# EAGLE design Qwiic_Power_Meter-ACS37800 (EAGLE 9.6.2)
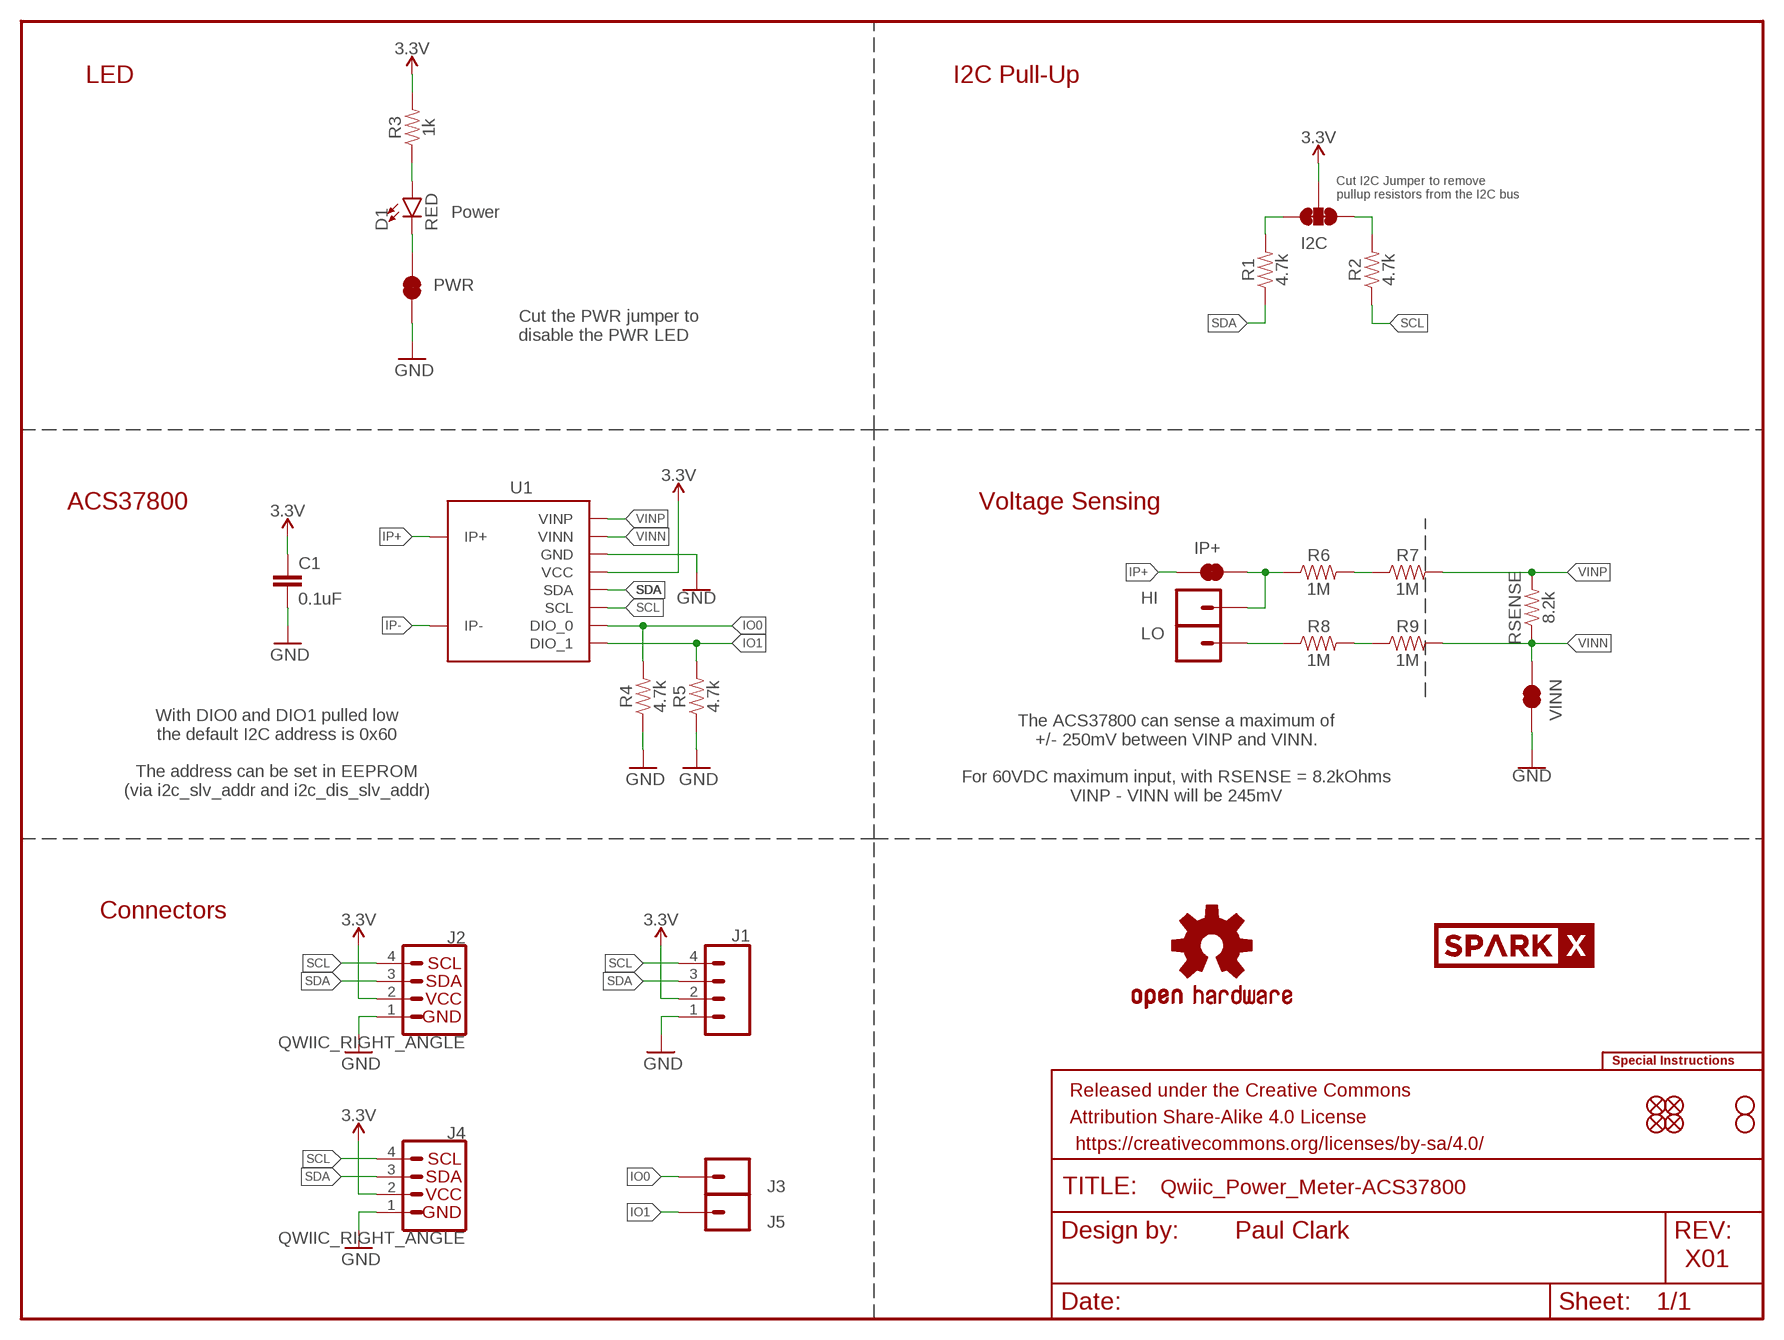
[diagram p0: schematic, sheet 1]

## Parts
C1  0.1uF  0.1UF-0603-25V-(+80/-20%)  [0603]
D1  RED  LED-RED0603  [LED-0603]
FRAME1  FRAME-LETTER  [CREATIVE_COMMONS]
HI  CONN_01PTH_NO_SILK_YES_STOP  [1X01_NO_SILK]
I2C  JUMPER-SMT_3_2-NC_TRACE_SILK  [SMT-JUMPER_3_2-NC_TRACE_SILK]
IP+  JUMPER-SMT_2_NC_TRACE_SILK  [SMT-JUMPER_2_NC_TRACE_SILK]
J1  CONN_041X04_NO_SILK  [1X04_NO_SILK]
J2  QWIIC_RIGHT_ANGLE  QWIIC_CONNECTORJS-1MM  [JST04_1MM_RA]
J3  CONN_01PTH_NO_SILK_YES_STOP  [1X01_NO_SILK]
J4  QWIIC_RIGHT_ANGLE  QWIIC_CONNECTORJS-1MM  [JST04_1MM_RA]
J5  CONN_01PTH_NO_SILK_YES_STOP  [1X01_NO_SILK]
JP1  FIDUCIALUFIDUCIAL  [MICRO-FIDUCIAL]
JP2  FIDUCIALUFIDUCIAL  [MICRO-FIDUCIAL]
JP3  STAND-OFF  [STAND-OFF]
JP4  STAND-OFF  [STAND-OFF]
JP5  FIDUCIALUFIDUCIAL  [MICRO-FIDUCIAL]
JP6  FIDUCIALUFIDUCIAL  [MICRO-FIDUCIAL]
LO  CONN_01PTH_NO_SILK_YES_STOP  [1X01_NO_SILK]
LOGO1  SPECIAL_INSTRUCTIONS-ORDERING  [ORDERING_INSTRUCTIONS]
LOGO5  OSHW-LOGOS  [OSHW-LOGO-S]
PWR  JUMPER-SMT_2_NC_TRACE_SILK  [SMT-JUMPER_2_NC_TRACE_SILK]
R1  4.7k  4.7KOHM-0603-1/10W-1%  [0603]
R2  4.7k  4.7KOHM-0603-1/10W-1%  [0603]
R3  1k  1KOHM-0603-1/10W-1%  [0603]
R4  4.7k  4.7KOHM-0603-1/10W-1%  [0603]
R5  4.7k  4.7KOHM-0603-1/10W-1%  [0603]
R6  1M  1MOHM-0603-1/4W-5%  [0603]
R7  1M  1MOHM-0603-1/4W-5%  [0603]
R8  1M  1MOHM-0603-1/4W-5%  [0603]
R9  1M  1MOHM-0603-1/4W-5%  [0603]
RSENSE  8.2k  8.2KOHM-0603-1/10W-5%  [0603]
U1  ACS37800  [ACS37800_THROUGH_HOLE]
U$18  SPARKX-LOGO3  [SPARKX-SMALL]
VINN  JUMPER-SMT_2_NC_TRACE_SILK  [SMT-JUMPER_2_NC_TRACE_SILK]

## Nets
3.3V: C1.1 I2C.2 J1.2 J2.2 J4.2 R3.2 U1.13(VCC)
GND: C1.2 J1.1 J2.1 J4.1 PWR.1 R4.1 R5.1 U1.14(GND) VINN.2
HI: HI.1 IP+.2 R6.1
IO0: J3.1 R4.2 U1.10(DIO_0)
IO1: J5.1 R5.2 U1.9(DIO_1)
IP+: IP+.1 U1.1(IP+) U1.2(IP+) U1.3(IP+) U1.4(IP+) U1.C_IN(IP+) U1.C_IN_BREAKOUT(IP+) U1.CIN1(IP+) U1.CIN2(IP+) U1.CIN3(IP+) U1.CIN4(IP+) U1.CIN5(IP+) U1.CIN6(IP+) U1.CIN7(IP+) U1.CIN8(IP+) U1.CIN9(IP+) U1.CIN10(IP+) U1.CIN11(IP+) U1.CIN12(IP+) U1.CIN13(IP+) U1.CIN14(IP+) U1.CIN15(IP+) U1.CIN16(IP+) U1.CIN17(IP+) U1.CIN18(IP+) U1.CIN19(IP+) U1.CIN20(IP+) U1.CIN21(IP+) U1.CIN22(IP+) U1.CIN23(IP+) U1.CIN24(IP+) U1.CIN25(IP+) U1.CIN26(IP+) U1.CIN27(IP+) U1.CIN28(IP+) U1.CIN29(IP+) U1.CIN30(IP+) U1.CIN31(IP+) U1.CIN32(IP+) U1.CIN33(IP+) U1.CIN34(IP+) U1.CIN35(IP+) U1.CIN36(IP+)
IP-: U1.5(IP-) U1.6(IP-) U1.7(IP-) U1.8(IP-) U1.C_OUT(IP-) U1.C_OUT_BREAKOUT(IP-) U1.COUT1(IP-) U1.COUT2(IP-) U1.COUT3(IP-) U1.COUT4(IP-) U1.COUT5(IP-) U1.COUT6(IP-) U1.COUT7(IP-) U1.COUT8(IP-) U1.COUT9(IP-) U1.COUT10(IP-) U1.COUT11(IP-) U1.COUT12(IP-) U1.COUT13(IP-) U1.COUT14(IP-) U1.COUT15(IP-) U1.COUT16(IP-) U1.COUT17(IP-) U1.COUT18(IP-) U1.COUT19(IP-) U1.COUT20(IP-) U1.COUT21(IP-) U1.COUT22(IP-) U1.COUT23(IP-) U1.COUT24(IP-) U1.COUT25(IP-) U1.COUT26(IP-) U1.COUT27(IP-) U1.COUT28(IP-) U1.COUT29(IP-) U1.COUT30(IP-) U1.COUT31(IP-) U1.COUT32(IP-) U1.COUT33(IP-) U1.COUT34(IP-) U1.COUT35(IP-) U1.COUT36(IP-)
N$1: D1.C PWR.2
N$2: I2C.3 R1.2
N$3: D1.A R3.1
N$4: I2C.1 R2.2
N$5: R6.2 R7.1
N$6: R8.2 R9.1
N$8: LO.1 R8.1
SCL: J1.4 J2.4 J4.4 R2.1 U1.11(SCL)
SDA: J1.3 J2.3 J4.3 R1.1 U1.12(SDA)
VINN: R9.2 RSENSE.1 U1.15(VINN) VINN.1
VINP: R7.2 RSENSE.2 U1.16(VINP)

## Notes on the sheet
- LED | I2C Pull-Up
- Cut I2C Jumper to remove 
  pullup resistors from the I2C bus
- Power
- Cut the PWR jumper to
  disable the PWR LED
- ACS37800 | Voltage Sensing
- With DIO0 and DIO1 pulled low
  the default I2C address is 0x60
  
  The address can be set in EEPROM
  (via i2c_slv_addr and i2c_dis_slv_addr)
- The ACS37800 can sense a maximum of
  +/- 250mV between VINP and VINN.
  
  For 60VDC maximum input, with RSENSE = 8.2kOhms
  VINP - VINN will be 245mV
- Connectors
- Paul Clark
- X01

## Library data of the parts
C1 = SparkFun-Capacitors:0.1UF: 0.1µF ceramic capacitors A capacitor is a passive two-terminal electrical component used to store electrical energy temporarily in an electric field.; PROD_ID: CAP-00810
D1 = SparkFun-LED:LED-RED: Red SMD LED Used in manufacturing of most products at SparkFun Packages: 0603 - SMD 0603 package [Product Link] <http://docs.avagotech.com/docs/AV02-0551EN> 0603 SMART - SMD 0603 SMART package ( more efficient and expensive)[Product Link] <http://www.osram-os.com/Graphics/XPic2/00077099_0.pdf> 1206 - SMD1206 package [Product Link] <https://www.sparkfun.com/datasheets/DevTools/LilyPad/Q150OVS4.pdff> SparkFun Products: Pro Mini 328 -5V <https://www.sparkfun.com/products/821> RedBoard <https://www.sparkfun.com/products/12757> IOIO-OTG <https://www.sparkfun.com/products/13613>; PROD_ID: DIO-00819
FRAME1 = SparkFun-Aesthetics:FRAME-LETTER: Schematic Frame - Letter Standard 8.5x11 US Letter frame
HI J3 J5 LO = SparkFun-Connectors:CONN_01: Single connection point. Often used as Generic Header-pin footprint for 0.1 inch spaced/style header connections On any of the 0.1 inch spaced packages, you can populate with these: Break Away Headers - Straight <https://www.sparkfun.com/products/116> (PRT-00116) Break Away Male Headers - Right Angle <https://www.sparkfun.com/products/553> (PRT-00553) Female Headers <https://www.sparkfun.com/products/115> (PRT-00115) Break Away Headers - Machine Pin <https://www.sparkfun.com/products/117> (PRT-00117) Break Away Female Headers - Swiss Machine Pin <https://www.sparkfun.com/products/743> (PRT-00743) This device is also useful as a general connection point to wire up your design to another part of your project. Our various solder wires solder well into these plated through hole pads. Hook-Up Wire - Assortment (Stranded, 22 AWG) <https://www.sparkfun.com/products/11375> (PRT-11375) Hook-Up Wire - Assortment (Solid Core, 22 AWG) <https://www.sparkfun.com/products/11367> (PRT-11367) View the entire wire category on our website here <https://www.sparkfun.com/categories/141> Special notes: SMTSO-256-ET is a "flush mount" nut for a 4-40 screw. We mostly use this on specialty testbeds; it is a nice way to connect hardware to your PCB at an adjustable hieght. Also note, the SNAP packages are for using a snappable style connector. We sell a baggie of snaps and they are also used on two LilyPad designs: Snap Assortment - 30 pack (male and female) <https://www.sparkfun.com/products/11347> (DEV-11347) LilyPad Arduino SimpleSnap <https://www.sparkfun.com/products/10941> (DEV-10941) LilyPad SimpleSnap Protoboard <https://www.sparkfun.com/products/10940> (DEV-10940)
I2C = SparkFun-Jumpers:JUMPER-SMT_3_2-NC_TRACE: Normally closed trace jumper (2 of 2 connections) This jumper has a trace between all three pads so they are normally closed (NC). Use a razor knife to open the connection(s). For best results follow the IPC guidelines for cutting traces: Cutout at least 0.063 mm (0.005 in). Remove all loose material to clean up the cut area. Seal the cut with an approved epoxy. Reapply solder to reclose the connection(s).
IP+ PWR VINN = SparkFun-Jumpers:JUMPER-SMT_2_NC_TRACE: Normally closed trace jumper This jumper has a trace between two pads so it's normally closed (NC). Use a razor knife to open the connection. For best results follow the IPC guidelines for cutting traces: Cutout at least 0.063 mm (0.005 in). Remove all loose material to clean up the cut area. Seal the cut with an approved epoxy. Reapply solder to reclose the connection.
J1 = SparkFun-Connectors:CONN_04: Multi connection point. Often used as Generic Header-pin footprint for 0.1 inch spaced/style header connections On any of the 0.1 inch spaced packages, you can populate with these: Break Away Headers - Straight <https://www.sparkfun.com/products/116> (PRT-00116) Break Away Male Headers - Right Angle <https://www.sparkfun.com/products/553> (PRT-00553) Female Headers <https://www.sparkfun.com/products/115> (PRT-00115) Break Away Headers - Machine Pin <https://www.sparkfun.com/products/117> (PRT-00117) Break Away Female Headers - Swiss Machine Pin <https://www.sparkfun.com/products/743> (PRT-00743) For SCREWTERMINALS and SPRING TERMINALS visit here: Screw Terimnals on SparkFun.com <https://www.sparkfun.com/search/results?term=Screw+Terminals> (5mm/3.5mm/2.54mm spacing) This device is also useful as a general connection point to wire up your design to another part of your project. Our various solder wires solder well into these plated through hole pads. Hook-Up Wire - Assortment (Stranded, 22 AWG) <https://www.sparkfun.com/products/11375> (PRT-11375) Hook-Up Wire - Assortment (Solid Core, 22 AWG) <https://www.sparkfun.com/products/11367> (PRT-11367) View the entire wire category on our website here <https://www.sparkfun.com/categories/141> Special notes: Molex polarized connector foot print use with SKU : PRT-08231 with associated crimp pins and housings. 1MM SMD Version SKU: PRT-10208; PROD_ID: CONN-09696
J2 J4 = SparkFun-Connectors:QWIIC_CONNECTOR: SparkFun I2C Standard Qwiic Connector An SMD 1mm pitch JST connector makes it easy and quick (get it? Qwiic?) to connect I2C devices to each other. The Qwiic system <http://www.sparkfun.com/qwiic> enables fast and solderless connection between popular platforms and various sensors and actuators. We carry 200mm <https://www.sparkfun.com/products/14204>, 100mm <https://www.sparkfun.com/products/14205>, 50mm <https://www.sparkfun.com/products/14206>, and breadboard friendly <https://www.sparkfun.com/products/14207> Qwiic cables. We also offer 10 pcs strips <https://www.sparkfun.com/products/14323> the SMD connectors.; PROD_ID: CONN-13694
JP1 JP2 JP5 JP6 = SparkFun:FIDUCIAL: Fiducial Alignment Points Various fiducial points for machine vision alignment.
JP3 JP4 = SparkFun:STAND-OFF: Stand Off This is the mechanical footprint for a #4 phillips button head screw. Use the keepout ring to avoid running the screw head into surrounding components. SKU : PRT-00447
LOGO1 = SparkFun-Aesthetics:SPECIAL_INSTRUCTIONS: Special Ordering/Production Instructions Alert Symbol for special PCB ordering instructions or unique production process warnings. Ordering Instructions Production Instructions Types of information that should be added to box: Copper weight Soldermask color Silk color PCB thickness Number of layers PCB Standard: 1.6mm FR4 1 oz copper immersion silver plating red soldermask white silkscreen Types of information that should be added to box: Special wash requirements Depaneling instructions Humidification Glue curing Default text settings: 0.07 inch 9% ratio 50% line distance
LOGO5 = SparkFun-Aesthetics:OSHW-LOGO: Open-Source Hardware (OSHW) Logo This logo indicates the piece of hardware it is found on incorporates a OSHW license and/or adheres to the definition of open source hardware found here: http://freedomdefined.org/OSHW
R1 R2 R4 R5 = SparkFun-Resistors:4.7KOHM: 4.7kΩ resistor A resistor is a passive two-terminal electrical component that implements electrical resistance as a circuit element. Resistors act to reduce current flow, and, at the same time, act to lower voltage levels within circuits. - Wikipedia; PROD_ID: RES-07857
R3 = SparkFun-Resistors:1KOHM: 1kΩ resistor A resistor is a passive two-terminal electrical component that implements electrical resistance as a circuit element. Resistors act to reduce current flow, and, at the same time, act to lower voltage levels within circuits. - Wikipedia; PROD_ID: RES-07856
R6-R9 = SparkFun-Resistors:1MOHM: 1MΩ resistor A resistor is a passive two-terminal electrical component that implements electrical resistance as a circuit element. Resistors act to reduce current flow, and, at the same time, act to lower voltage levels within circuits. - Wikipedia; PROD_ID: RES-07868
RSENSE = SparkFun-Resistors:8.2KOHM: 8.2kΩ resistor A resistor is a passive two-terminal electrical component that implements electrical resistance as a circuit element. Resistors act to reduce current flow, and, at the same time, act to lower voltage levels within circuits. - Wikipedia; PROD_ID: RES-10646
U1 = New-Parts_SparkFun-IC-Power:ACS37800: Allegro MicroSystems ACS37800 power monitoring IC; DIGIKEY_PART: 620-ACS37800KMACTR-030B3-I2CCT-ND; MANU_PART: ACS37800KMACTR-030B3-I2C; PROD_ID: IC-15728
U$18 = SparkX:SPARKX-LOGO

## Net classes
1 power: width 0.203 mm

## Board
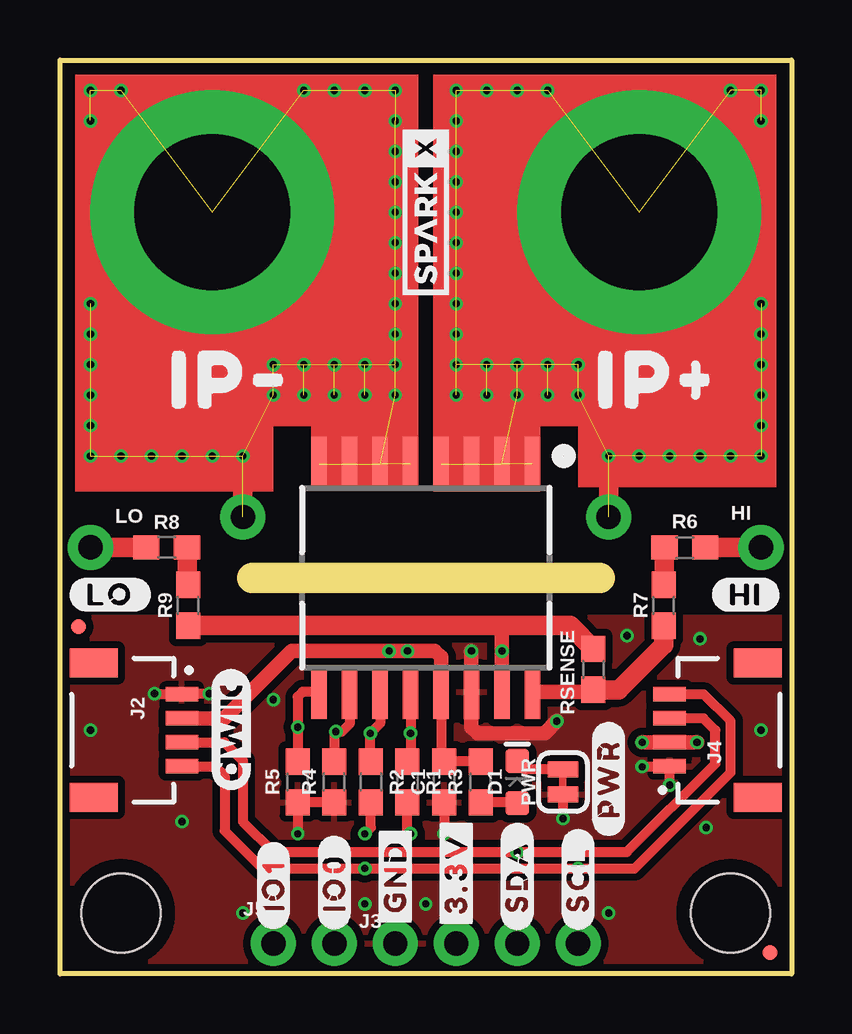
[diagram p1: board, top side]
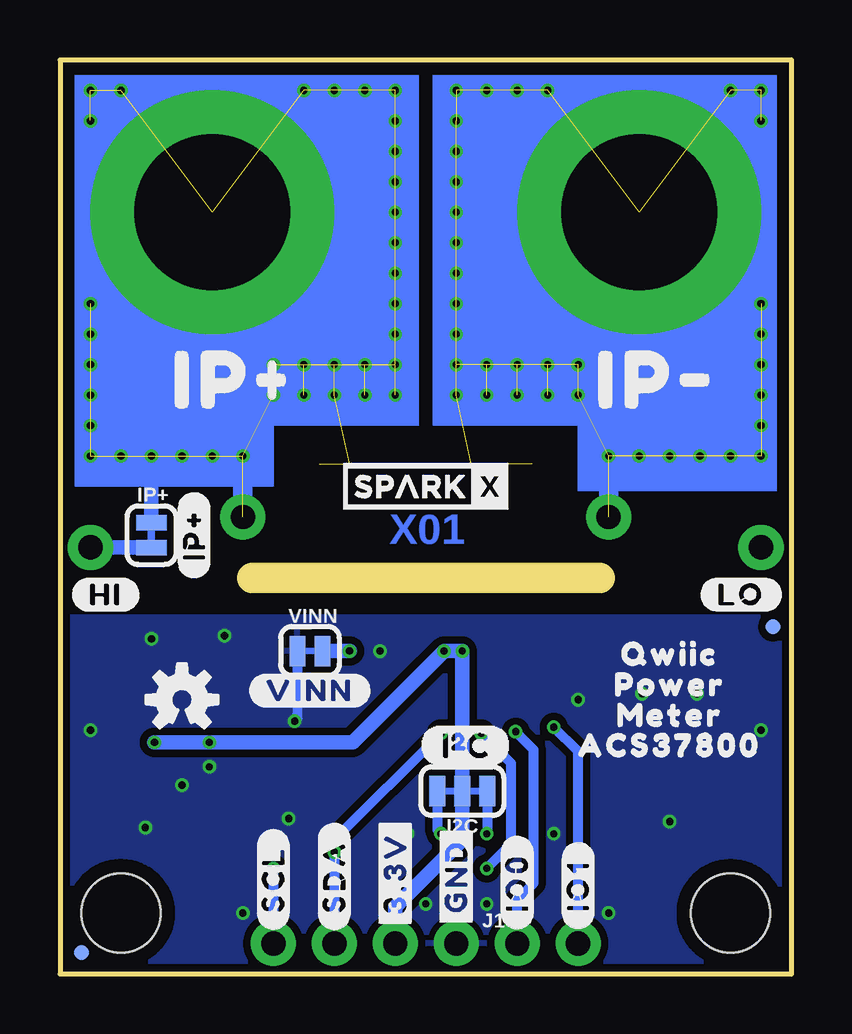
[diagram p2: board, bottom side, seen from below]

Size 30.48 x 38.1 mm. Coordinates in mm from the lower left corner, seen from the top.
Outline: 0,0 0,38.1 30.48,38.1 30.48,0 0,0
Copper layers (1+2*15+16): Top 0.035mm / dielectric 0.2mm / Route2 0.0175mm / dielectric 1.065mm / Route15 0.0175mm / dielectric 0.2mm / Bottom 0.035mm
Design rules "SparkFun-4-layer-1oz-JLCPCB": minimum track width 5mil, minimum drill 0.2mm, track to track 5mil, track to pad 0.2mm, pad to pad 5mil, via to via 0.2mm, smd to smd 0mil, copper to edge 0.2mm, drill to drill 10mil, minimum pad ring 0.13mm, minimum via ring 0.13mm, stop-mask expansion 0.05mm, vias tented up to drill 25mil, thermal gap 10mil

### Footprints (pad centres in the part's own frame; a part is rotated, then mirrored left to right if it is on the bottom)
0603 = smd 1.1 x 1: 1 -0.85,0; 2 0.85,0
LED-0603 = smd 1 x 1: A -0.877,0; C 0.877,0
1X01_NO_SILK = drill 1.016 pad 1.88: 1 0,0
SMT-JUMPER_3_2-NC_TRACE_SILK = smd 0.66 x 1.27: 1 -1.041,0; 2 0,0; 3 1.041,0
SMT-JUMPER_2_NC_TRACE_SILK = smd 0.66 x 1.27: 1 -0.521,0; 2 0.521,0
1X04_NO_SILK = drill 1.016 pad 1.88: 1 0,0; 2 2.54,0; 3 5.08,0; 4 7.62,0
JST04_1MM_RA = smd 0.6 x 1.35: 1 -1.5,0; 2 -0.5,0; 3 0.5,0; 4 1.5,0 | smd 1.2 x 2: NC1 2.8,-3.675; NC2 -2.8,-3.675
MICRO-FIDUCIAL = smd 0.635 x 0.635: 1 0,0
STAND-OFF = hole 3.302: 0,0
ACS37800_THROUGH_HOLE = smd 2.25 x 0.65: 1 -4.75,4.445; 2 -4.75,3.175; 3 -4.75,1.905; 4 -4.75,0.635; 5 -4.75,-0.635; 6 -4.75,-1.905; 7 -4.75,-3.175; 8 -4.75,-4.445; 9 4.75,-4.445; 10 4.75,-3.175; 11 4.75,-1.905; 12 4.75,-0.635; 13 4.75,0.635; 14 4.75,1.905; 15 4.75,3.175; 16 4.75,4.445 | drill 6.5 pad 10.16: C_IN -15.24,8.89; C_OUT -15.24,-8.89 | drill 1.016 pad 1.88: C_IN_BREAKOUT -2.54,7.62; C_OUT_BREAKOUT -2.54,-7.62 | drill 0.3: CIN1 -20.32,13.97; CIN2 -20.32,12.7; CIN3 -20.32,5.08; CIN4 -20.32,3.81; CIN5 -20.32,2.54; CIN6 -20.32,1.27; CIN7 -19.05,1.27; CIN8 -17.78,1.27; CIN9 -16.51,1.27; CIN10 -15.24,1.27; CIN11 -13.97,1.27; CIN12 -12.7,1.27; CIN13 -11.43,1.27; CIN14 -10.16,1.27; CIN15 -8.89,1.27; CIN16 -7.62,1.27; CIN17 -8.89,2.54; CIN18 -7.62,2.54; CIN19 -8.89,3.81; CIN20 -7.62,3.81; CIN21 -8.89,5.08; CIN22 -7.62,5.08; CIN23 -8.89,6.35; CIN24 -7.62,6.35; CIN25 -5.08,7.62; CIN26 -5.08,8.89; CIN27 -5.08,10.16; CIN28 -5.08,11.43; CIN29 -5.08,12.7; CIN30 -5.08,13.97; CIN31 -6.35,13.97; CIN32 -7.62,13.97; CIN33 -8.89,13.97; CIN34 -10.16,13.97; CIN35 -11.43,13.97; CIN36 -19.05,13.97; COUT1 -20.32,-13.97; COUT2 -19.05,-13.97; COUT3 -11.43,-13.97; COUT4 -10.16,-13.97; COUT5 -8.89,-13.97; COUT6 -7.62,-13.97; COUT7 -6.35,-13.97; COUT8 -5.08,-13.97; COUT9 -5.08,-12.7; COUT10 -5.08,-11.43; COUT11 -5.08,-10.16; COUT12 -5.08,-8.89; COUT13 -5.08,-7.62; COUT14 -7.62,-6.35; COUT15 -8.89,-6.35; COUT16 -7.62,-5.08; COUT17 -8.89,-5.08; COUT18 -7.62,-3.81; COUT19 -8.89,-3.81; COUT20 -7.62,-2.54; COUT21 -8.89,-2.54; COUT22 -7.62,-1.27; COUT23 -8.89,-1.27; COUT24 -10.16,-1.27; COUT25 -11.43,-1.27; COUT26 -12.7,-1.27; COUT27 -13.97,-1.27; COUT28 -15.24,-1.27; COUT29 -16.51,-1.27; COUT30 -17.78,-1.27; COUT31 -19.05,-1.27; COUT32 -20.32,-1.27; COUT33 -20.32,-2.54; COUT34 -20.32,-3.81; COUT35 -20.32,-5.08; COUT36 -20.32,-12.7

### Placement (x,y rotation side)
C1  16,8 270 top
D1  19.05,8 90 top
FRAME1  62.23,-13.97 0 top  (outside the outline)
HI  29.21,17.78 0 top
I2C  13.72,7.62 180 bottom
IP+  26.67,18.29 270 bottom
J1  13.97,1.27 180 bottom
J2  5.08,10.16 270 top
J3  11.43,1.27 0 top
J4  25.4,10.16 90 top
J5  8.89,1.27 0 top
JP1  0.76,14.48 0 bottom
JP2  29.59,0.89 0 top
JP3  2.54,2.54 0 top
JP4  27.94,2.54 0 top
JP5  29.59,0.89 0 bottom
JP6  0.76,14.48 0 top
LO  1.27,17.78 0 top
LOGO1  41.91,45.72 0 top  (outside the outline)
LOGO5  25.4,11.43 0 bottom
PWR  20.95,8 90 top
R1  14.48,8 270 top
R2  12.95,8 270 top
R3  17.53,8 90 top
R4  11.43,8 90 top
R5  9.91,8 90 top
R6  26.04,17.78 180 top
R7  25.15,15.37 270 top
R8  4.45,17.78 0 top
R9  5.33,15.37 270 top
RSENSE  22.23,12.7 270 top
U1  15.24,16.51 270 top
U$1  [#GND#0]  13.97,4.06 90 bottom
U$2  [#3#3V#0]  16.51,4.19 90 bottom
U$3  [#SDA#0]  19.05,4.06 90 bottom
U$4  [#SCL#0]  21.59,3.94 90 bottom
U$5  [#IO0#0]  11.43,3.81 90 top
U$6  [#IO0#0]  11.43,3.81 90 bottom
U$7  [#IO1#0]  8.89,3.68 90 top
U$8  [#IO1#0]  8.89,3.68 90 bottom
U$9  [IP#0]  24.89,24.77 0 top
U$10  [IP#0]  23.24,24.77 0 bottom
U$11  [IP#0]  7.11,24.77 0 top
U$12  [IP#0]  5.59,24.77 0 bottom
U$13  [#HI#0]  28.57,15.81 0 top
U$14  [#HI#0]  28.57,15.81 0 bottom
U$15  [I2C]  15.49,9.53 0 bottom
U$16  [QWIIC_5MM]  7.11,10.16 90 top
U$17  [#LO#0]  2.1,15.81 0 top
U$18  15.24,20.32 0 bottom
U$19  [#LO#0]  2.1,15.81 0 bottom
U$20  SPARKX-LOGO3  [SPARKX-SMALL]  15.24,31.75 90 top
U$21  [#VINN#0]  20.07,11.81 0 bottom
U$22  [#IP##0]  24.89,18.29 90 bottom
U$23  [ACS378000]  5.08,9.53 0 bottom
U$24  [METER0]  5.08,10.79 0 bottom
U$25  [POWER0]  5.08,12.06 0 bottom
U$26  [QWIIC0]  5.08,13.34 0 bottom
U$32  [#PWR#0]  22.86,8.13 90 top
U$33  [#GND#0]  13.97,4.06 90 top
U$34  [#3#3V#0]  16.51,4.19 90 top
U$35  [#SDA#0]  19.05,4.06 90 top
U$36  [#SCL#0]  21.59,3.94 90 top
VINN  20.07,13.46 180 bottom

### Tracks (layer width: path | path; a pad name or v marks a point on that pad's centre or on a via)
3.3V  (via drill 0.3)
  Top 0.406: U1.13 15.88,8.98 C1.1 R3.2
  Top 0.61: J2.2 6.85,10.66 9.65,13.46 v13.72,13.46 v14.48,13.46 15.62,13.46 15.88,13.21 U1.13 | v24.26,9.65 v24.27,9.66 J4.2 v26.54,9.66 v26.54,9.65
  Bottom 0.61: J1.2 16.51,2.79 13.72,5.59 I2C.2 v13.72,13.46 v14.48,13.46 18.29,9.65 v24.26,9.65 v26.54,9.65
GND  (via drill 0.3)
  Top 0.406: PWR.1 v20.95,6.48 | C1.2 v16,5.84 | v9.91,5.84 R5.1 R4.1 | v3.94,11.68 3.96,11.66 J2.1 5.1,11.68 v6.22,11.68 | v24.26,8.64 24.28,8.66 J4.1 v25.4,7.87
  Top 0.61: v17.14,13.46 U1.14 17.14,10.29 17.4,10.03 20.19,10.03 v20.7,10.54
  Bottom 0.406: VINN.2 20.59,10.65 v20.7,10.54
  other vias: 23.62,14.1 26.67,13.97 29.21,10.16 26.92,6.1 22.86,2.54 12.7,2.92 15.24,2.92 7.62,2.54 5.08,6.35 1.27,10.16 8.89,11.43
  pour Bottom (isolate 0.305): 0,0 0,14.86 30.48,14.86 30.48,0
  pour Top (isolate 0.305): 0,0 0,14.86 30.48,14.86 30.48,0
HI
  Top 0.813: R6.1 HI.1
  Bottom 0.61: IP+.2 26.68,17.78 HI.1
IO0  (via drill 0.3)
  Top 0.406: U1.10 12.06,10.41 11.75,10.1 v11.49,10.1 11.43,10.03 R4.2
  Bottom 0.406: J3.1 11.43,3.1 10.75,3.78 10.75,9.35 v11.49,10.1
IO1  (via drill 0.3)
  Top 0.406: U1.9 10.11,11.76 9.91,11.56 v9.91,10.29 R5.2
  Bottom 0.406: J5.1 8.89,9.27 v9.91,10.29
IP+  (41 unrouted)
  Bottom 0.61: IP+.1 U1.CIN28
IP-  (41 unrouted)
N$1
  Top 0.406: PWR.2 19.41,8.52 D1.C
N$2  (via drill 0.3)
  Top 0.406: v14.61,5.84 14.48,5.97 R1.2
  Bottom 0.406: I2C.3 14.76,5.99 v14.61,5.84
N$3
  Top 0.406: D1.A 19.02,7.15 R3.1
N$4  (via drill 0.3)
  Top 0.406: v12.7,5.84 12.95,6.1 R2.2
  Bottom 0.406: I2C.1 12.68,5.87 v12.7,5.84
N$5
  Top 0.813: R7.1 25.18,16.26 R6.2
N$6
  Top 0.813: R8.2 5.29,16.26 R9.1
N$8
  Top 0.813: R8.1 LO.1
SCL  (via drill 0.3)
  Top 0.406: J2.4 6.45,8.66 6.86,8.26 6.86,5.97 8.43,4.4 v12.7,4.4 v21.59,4.4 23.94,4.4 27.94,8.39 27.94,10.54 26.82,11.66 J4.4 | U1.11 13.34,10.44 v12.93,10.03 12.93,8.87 R2.1
  Bottom 0.406: v21.59,4.4 J1.4 | v12.7,4.4 11.68,5.41 11.68,8.79 v12.93,10.03
SDA  (via drill 0.3)
  Top 0.406: U1.12 v14.61,10.03 14.61,8.98 R1.1 | J2.3 6.85,9.66 7.62,8.89 7.62,6.35 8.89,5.08 v19.05,5.08 23.62,5.08 27.3,8.76 27.3,10.16 26.8,10.66 J4.3
  Bottom 0.406: J1.3 v19.05,5.08 19.05,5.59 v14.61,10.03
VINN  (via drill 0.3)
  Top 0.61: U1.15 v18.41,13.46 18.41,14.52
  Top 0.813: R9.2 18.41,14.52 21.26,14.52 RSENSE.1
  Bottom 0.61: VINN.1 v18.41,13.46
VINP
  Top 0.61: U1.16 22.14,11.76 RSENSE.2
  Top 0.813: RSENSE.2 23.28,11.85 25.15,13.72 R7.2

### Text on the board
Bottom: X01
Measures: Ø0.25 | Dimensions in inches
tDocu: 2oz Copper / 2 Layers / 1.6mm Thickness / ENIG Finish | Paul Clark